# EAGLE design prelay__hvdc (EAGLE 4.91)
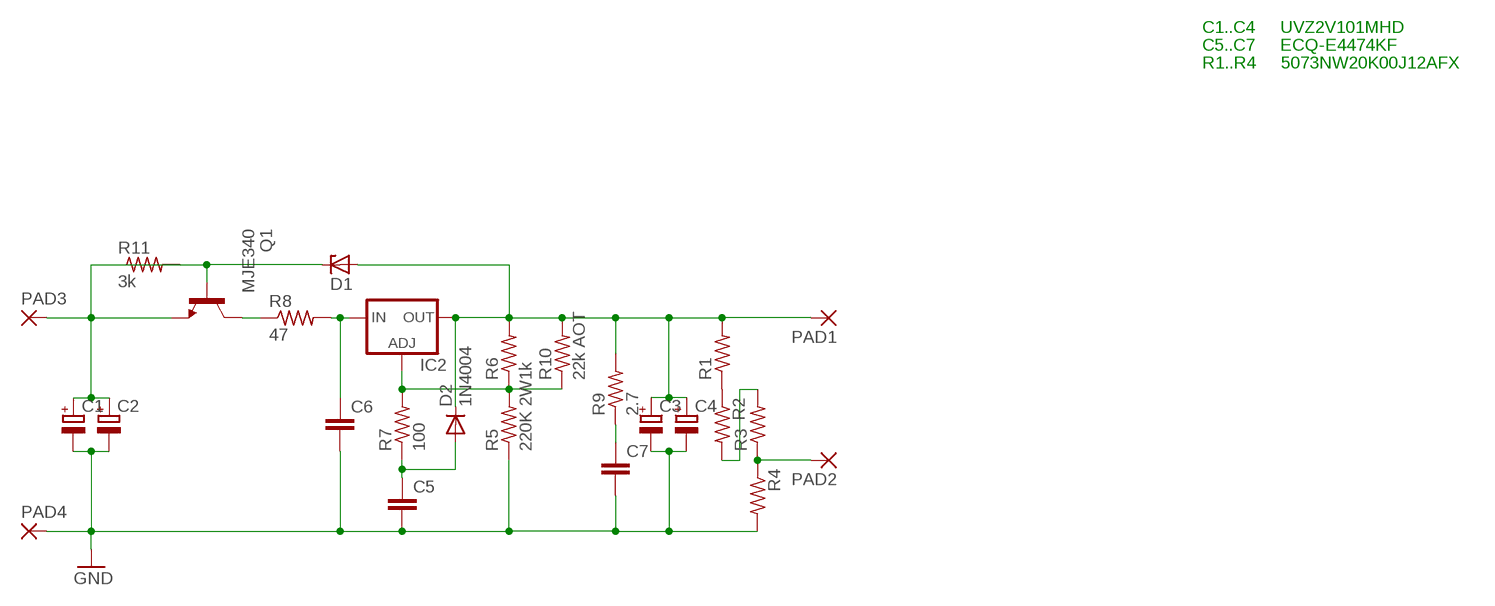
[diagram p0: schematic, sheet 1]

## Parts
C1  CPOL-EUE7.5-18  [E7,5-18]
C2  CPOL-EUE7.5-18  [E7,5-18]
C3  CPOL-EUE7.5-18  [E7,5-18]
C4  CPOL-EUE7.5-18  [E7,5-18]
C5  C-EU225-074X268  [C225-074X268]
C6  C-EU225-074X268  [C225-074X268]
C7  C-EU225-074X268  [C225-074X268]
D1  ZENER-DIODEZD-7.5  [ZDIO-7.5]
D2  1N4004  [DO41-10]
IC2  LM317TL  [317TL]
PAD1  3,17/1,3  [3,17/1,3]
PAD2  3,17/1,3  [3,17/1,3]
PAD3  3,17/1,3  [3,17/1,3]
PAD4  3,17/1,3  [3,17/1,3]
Q1  MJE340  [TO126]
R1  R-US_0411/3V  [0411V]
R2  R-US_0411/3V  [0411V]
R3  R-US_0411/3V  [0411V]
R4  R-US_0411/3V  [0411V]
R5  220K 2W  R-US_0414/5V  [0414V]
R6  1k  R-US_0309/12  [0309/12]
R7  100  R-US_0309/V  [0309V]
R8  47  R-US_0309/12  [0309/12]
R9  2.7  R-US_0309/V  [0309V]
R10  22k AOT  R-US_0309/12  [0309/12]
R11  3k  R-US_0309/V  [0309V]

## Nets
GND: C1.- C2.- C3.- C4.- C5.2 C6.2 C7.2 PAD4.1(P) R4.2 R5.1
N$1: C1.+ C2.+ PAD3.1(P) Q1.1(E) R11.2
N$2: D1.C Q1.3(B) R11.1
N$4: IC2.1(ADJ) R5.2 R6.1 R7.2 R10.1
N$5: C5.1 D2.A R7.1
N$6: Q1.2(C) R8.1
N$7: C6.1 IC2.3(IN) R8.2
N$8: C7.1 R9.1
N$9: R2.2 R3.2
N$10: R1.1 R2.1
N$11: PAD2.1(P) R3.1 R4.1
N$12: C3.+ C4.+ D1.A D2.C IC2.2(OUT) PAD1.1(P) R1.2 R6.2 R9.2 R10.2

## Notes on the sheet
- C1..C4     UVZ2V101MHD
- C5..C7     ECQ-E4474KF
- R1..R4     5073NW20K00J12AFX

## Library data of the parts
C1-C4 = rcl:CPOL-EU: POLARIZED CAPACITOR, European symbol
C5-C7 = rcl:C-EU: CAPACITOR, European symbol
D1 = diode:ZENER-DIODE: Z-Diode
D2 = diode:1N4004: DIODE general purpose rectifier, 1 A
IC2 = v-reg:LM317TL: VOLTAGE REGULATOR
PAD1-PAD4 = wirepad:3,17/1,3: THROUGH-HOLE PAD
Q1 = transistor-npn:MJE340*: NPN Transistor
R1-R4 R6-R11 = rcl:R-US_: RESISTOR, American symbol
R5 = resistor:R-US_: RESISTOR, American symbol

## Board
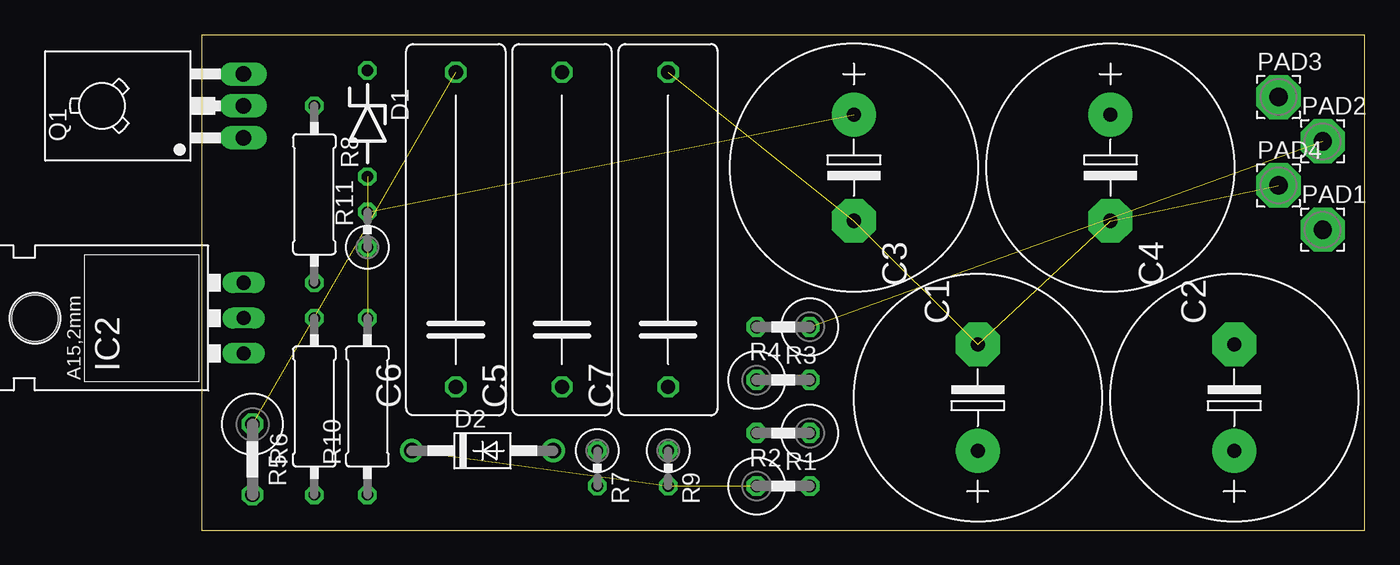
[diagram p1: board, top side]
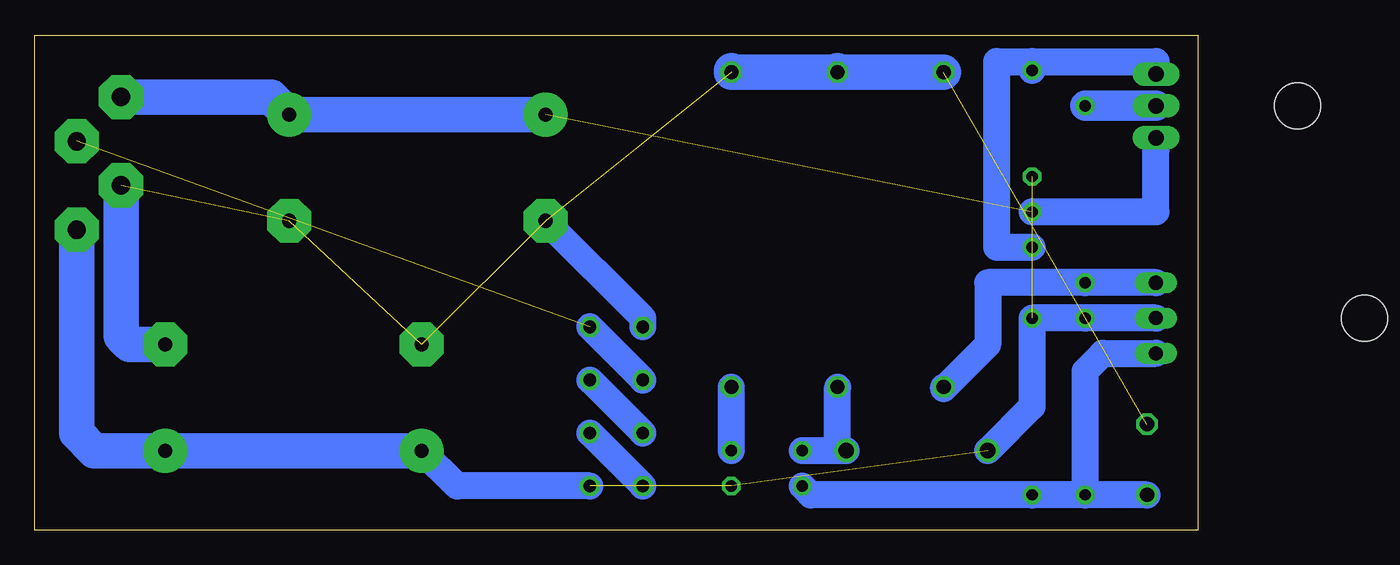
[diagram p2: board, bottom side, seen from below]

Size 83.49 x 35.55 mm. Coordinates in mm from the lower left corner, seen from the top.
Outline: 0,0 83.49,0 83.49,35.55 0,35.55 0,0
Copper layers (1*16): Top 0.035mm / dielectric 1.5mm / Bottom 0.035mm
Design rules "default": minimum track width 10mil, minimum drill 24mil, track to track 8mil, track to pad 8mil, pad to pad 8mil, via to via 8mil, smd to smd 8mil, copper to edge 40mil, drill to drill 8mil, minimum pad ring 10mil, minimum via ring 8mil, stop-mask expansion 4mil, vias tented up to drill 0mil, thermal gap 10mil

### Footprints (pad centres in the part's own frame; a part is rotated, then mirrored left to right if it is on the bottom)
E7,5-18 = drill 1.016 pad 3.15 round: + -3.81,0 | drill 1.016 pad 3.15 octagon: - 3.81,0
C225-074X268 = drill 1.016 octagon: 1 -11.303,0; 2 11.303,0
ZDIO-7.5 = drill 0.813 octagon: A 3.81,0; C -3.81,0
DO41-10 = drill 1.118 round: A 5.08,0; C -5.08,0
317TL = drill 1.016 long: 1 -2.54,-3.81; 2 0,-3.81; 3 2.54,-3.81 | hole 3.302: 0,11.176
3,17/1,3 = drill 1.321 pad 3.175 octagon: 1 0,0
TO126 = drill 1.118 long: 1 -2.286,-5.08; 2 0,-5.08; 3 2.286,-5.08 | hole 3.302: 0,5.08
0411V = drill 0.914 octagon: 1 -2.54,0; 2 1.27,0
0414V = drill 1.016 octagon: 1 -2.54,0; 2 2.54,0
0309/12 = drill 0.813 octagon: 1 -6.35,0; 2 6.35,0
0309V = drill 0.813 octagon: 1 -1.27,0; 2 1.27,0

### Placement (x,y rotation side)
C1  46.82,26.03 270 top
C2  65.24,26.03 270 top
C3  55.71,9.52 90 top
C4  74.13,9.52 90 top
C5  25.87,21.58 90 top
C6  18.25,21.58 90 top
C7  33.49,21.58 90 top
D1  11.9,29.2 270 top
D2  20.15,5.71 0 top
IC2  -0.8,15.24 90 top
PAD1  80.48,21.58 0 top
PAD2  80.48,27.93 0 top
PAD3  77.3,31.11 0 top
PAD4  77.3,24.76 0 top
Q1  -2.07,30.47 90 top
R1  42.38,3.17 0 top
R2  41.11,6.98 180 top
R3  42.38,10.79 0 top
R4  41.11,14.6 180 top
R5  3.64,5.08 270 top
R6  8.09,8.89 90 top
R7  28.41,4.44 270 top
R8  8.09,24.12 270 top
R9  33.49,4.44 270 top
R10  11.9,8.89 90 top
R11  11.9,21.58 90 top

### Tracks (layer width: path | path; a pad name or v marks a point on that pad's centre or on a via)
GND  (5 unrouted)
  Bottom 1.93: R4.2 39.84,15.24 C1.-
  Bottom 2.54: C6.2 25.74,32.89 25.87,33.02 C5.2 33.36,32.89 33.49,33.02 C7.2 | C4.- 76.67,13.33 77.3,13.97 PAD4.1
N$1  (1 unrouted)
  Bottom 0.61: 3.01,27.3 Q1.1
  Bottom 1.93: 3.01,27.3 3.01,22.86 R11.2
  Bottom 2.54: C1.+ C2.+ 66.51,31.11 PAD3.1
N$2
  Bottom 1.016: 3.01,33.65 Q1.3
  Bottom 1.93: R11.1 14.44,20.31 14.44,33.65 11.9,33.65 | 11.9,33.65 3.01,33.65 | 11.9,33.65 D1.C
N$4
  Bottom 1.93: IC2.1 6.82,12.7 8.09,11.43 R6.1 | R5.2 R6.1 | R6.1 R10.1 27.77,2.54 R7.2
N$5
  Bottom 1.93: 25.87,5.71 C5.1 | D2.A 25.87,5.71 | 25.87,5.71 R7.1
N$6
  Bottom 2.184: Q1.2 R8.1
N$7
  Bottom 1.93: IC2.3 R8.2 15.08,17.77 15.08,13.33 18.25,10.16 C6.1
N$8
  Bottom 1.93: R9.1 C7.1
N$9
  Bottom 1.93: R2.2 R3.2
N$10
  Bottom 1.93: R1.1 R2.1
N$11  (1 unrouted)
  Bottom 1.93: R3.1 R4.1
N$12  (3 unrouted)
  Bottom 1.93: IC2.2 R6.2 R10.2 11.9,8.89 D2.C | R1.2 53.17,3.17 C3.+
  Bottom 2.54: C3.+ C4.+ 79.21,5.71 80.48,6.98 PAD1.1